# EAGLE design apu_mega_shield (EAGLE 6.5.0)
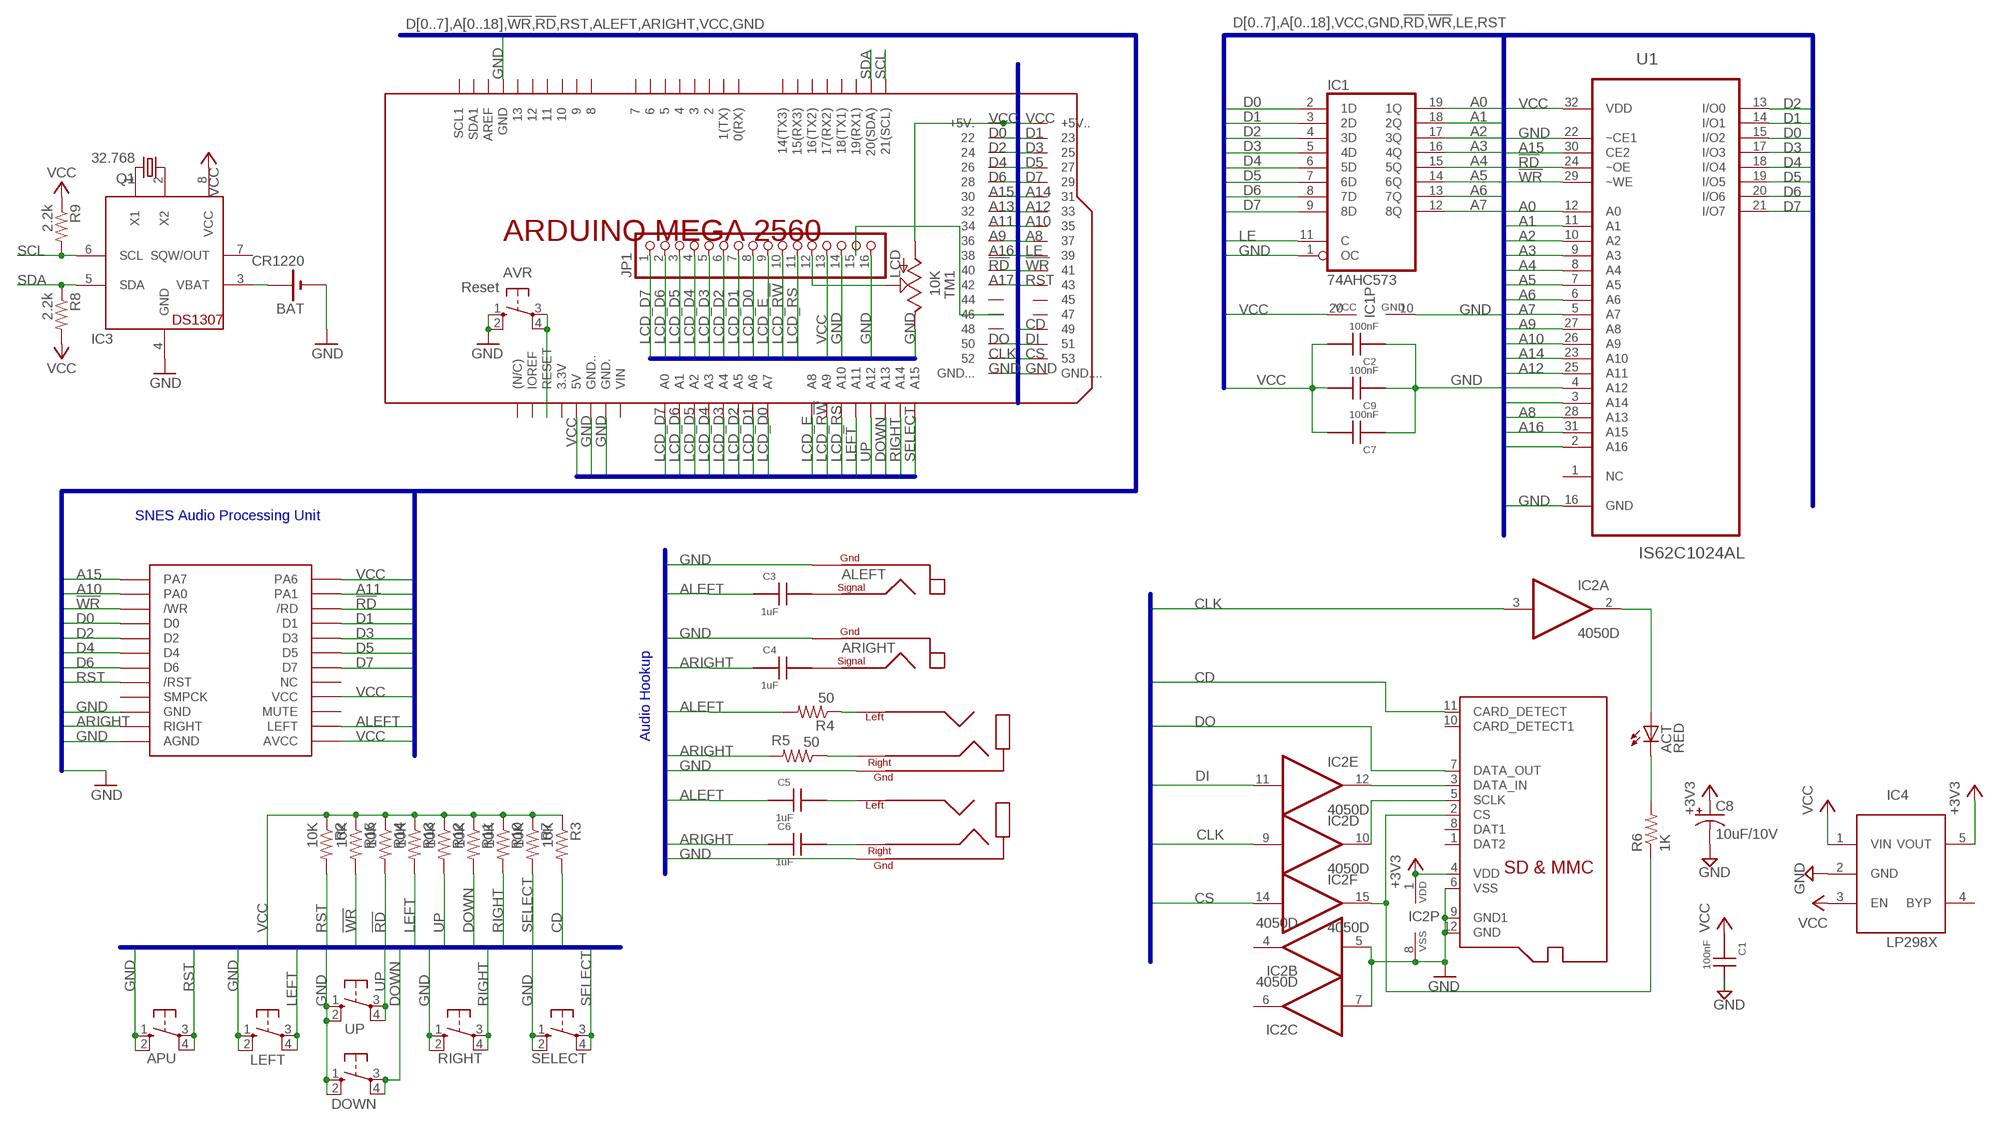
[diagram p0: schematic, sheet 1]

## Parts
ACT  RED  LEDCHIP-LED0805  [CHIP-LED0805]
APU  Reset  10-XX  [B3F-10XX]
AVR  Reset  10-XX  [B3F-10XX]
BAT  CR1220  CR1220SMT  [CR1220-SMD]
C1  100nF  C0805  [C0805]
C2  100nF  C0805  [C0805]
C3  1uF  C0805  [C0805]
C4  1uF  C0805  [C0805]
C5  1uF  C0805  [C0805]
C6  1uF  C0805  [C0805]
C7  100nF  C0805  [C0805]
C8  10uF/10V  CPOL-USA/3216-18R  [A/3216-18R]
C9  100nF  C0805  [C0805]
DOWN  10-XX  [B3F-10XX]
IC1  74AHC573  74HCT573D  [SO20W]
IC2  4050D  [SO16]
IC3  DS1307  DS1307SMT  [SO-08]
IC4  LP298XS  [SOT23-5L]
JP1  LCD  PINHD-1X16  [1X16]
LEFT  10-XX  [B3F-10XX]
Q1  32.768  CRYTALSMD  [SMD]
R2  10K  R-US_R0805  [R0805]
R3  10K  R-US_R0805  [R0805]
R4  50  R-US_R0805  [R0805]
R5  50  R-US_R0805  [R0805]
R6  1K  R-US_R0805  [R0805]
R7  10K  R-US_R0805  [R0805]
R8  2.2k  R-US_R0805  [R0805]
R9  2.2k  R-US_R0805  [R0805]
R10  10K  R-US_R0805  [R0805]
R11  10K  R-US_R0805  [R0805]
R12  10K  R-US_R0805  [R0805]
R13  10K  R-US_R0805  [R0805]
R14  10K  R-US_R0805  [R0805]
R15  10K  R-US_R0805  [R0805]
RIGHT  10-XX  [B3F-10XX]
SELECT  10-XX  [B3F-10XX]
TM1  10K  TRIM_US-CA6H  [CA6H]
U1  IS62C1024AL  IS62C1024AL-35QLI  [SOIC127P1412X305-32N]
U$1  APU  [APU]
U$2  HEADPHONE  [SJ1-3533N]
U$3  HEADPHONE  [SJ1-3533N]
U$4  RCA  [RCJ-01X]
U$5  RCA  [RCJ-01X]
U$6  ARDUINO_MEGA_2560_LITENO_LABELS  [ARDUINO_MEGA2560_LITE_NO_LABELS]
UP  10-XX  [B3F-10XX]
X1  MICROSDMOLEX  [MICROSD-1]

## Nets
!RD: R14.2 U1.24(~OE) U$1.P$6(/RD) U$6.40
!WR: R15.2 U1.29(~WE) U$1.P$5(/WR) U$6.41
+3V3 [supply]: C8.+ IC2.1(P:VDD) IC4.5(VOUT) X1.4(VDD)
A0: IC1.19(1Q) U1.12(A0)
A1: IC1.18(2Q) U1.11(A1)
A2: IC1.17(3Q) U1.10(A2)
A3: IC1.16(4Q) U1.9(A3)
A4: IC1.15(5Q) U1.8(A4)
A5: IC1.14(6Q) U1.7(A5)
A6: IC1.13(7Q) U1.6(A6)
A7: IC1.12(8Q) U1.5(A7)
A8: U1.28(A13) U$6.37
A9: U1.27(A8) U$6.36
A10: U1.26(A9) U$1.P$3(PA0) U$6.35
A11: U1.3(A14) U$1.P$4(PA1) U$6.34
A12: U1.25(A11) U$6.33
A13: U1.4(A12) U$6.32
A14: U1.23(A10) U$6.31
A15: U1.30(CE2) U$1.P$1(PA7) U$6.30
A16: U1.31(A15) U$6.38
A17: U1.2(A16) U$6.42
ALEFT [audio]: C3.1 C5.1 R4.2 U$1.P$22(LEFT)
ARIGHT [audio]: C4.1 C6.1 R5.2 U$1.P$21(RIGHT)
BUF_CLK: IC2.10(D:O) X1.5(SCLK)
BUF_CS: IC2.15(F:O) R6.1 X1.2(CS)
BUF_DI: IC2.12(E:O) X1.3(DATA_IN)
BUF_LED: ACT.A IC2.2(A:O)
CD: R3.2 U$6.49 X1.11(CARD_DETECT)
CLK: IC2.3(A:I) IC2.9(D:I) U$6.52
CS: IC2.14(F:I) U$6.53
D0: IC1.2(1D) U1.15(I/O2) U$1.P$7(D0) U$6.22
D1: IC1.3(2D) U1.14(I/O1) U$1.P$8(D1) U$6.23
D2: IC1.4(3D) U1.13(I/O0) U$1.P$9(D2) U$6.24
D3: IC1.5(4D) U1.17(I/O3) U$1.P$10(D3) U$6.25
D4: IC1.6(5D) U1.18(I/O4) U$1.P$11(D4) U$6.26
D5: IC1.7(6D) U1.19(I/O5) U$1.P$12(D5) U$6.27
D6: IC1.8(7D) U1.20(I/O6) U$1.P$13(D6) U$6.28
D7: IC1.9(8D) U1.21(I/O7) U$1.P$14(D7) U$6.29
DI: IC2.11(E:I) U$6.51
DO: U$6.50 X1.7(DATA_OUT)
DOWN: DOWN.3(P) DOWN.4(P1) R11.2 U$6.A13
GND [supply]: APU.1(S) APU.2(S1) AVR.1(S) AVR.2(S1) BAT.- C1.2 C2.1 C7.1 C8.- C9.1 DOWN.1(S) DOWN.2(S1) IC1.1(OC) IC1.10(GND) IC2.5(B:I) IC2.7(C:I) IC2.8(P:VSS) IC3.4(GND) IC4.2(GND) JP1.14 JP1.16 LEFT.1(S) LEFT.2(S1) RIGHT.1(S) RIGHT.2(S1) SELECT.1(S) SELECT.2(S1) TM1.E U1.16(GND) U1.22(~CE1) U$1.P$19(GND) U$1.P$23(AGND) U$2.GND U$3.GND U$4.PGND1 U$4.PGND2(PGND1) U$4.PGND3(PGND1) U$5.PGND1 U$5.PGND2(PGND1) U$5.PGND3(PGND1) U$6.GND U$6.GND. U$6.GND.. U$6.GND... U$6.GND.... UP.1(S) UP.2(S1) X1.6(VSS) X1.9(GND1) X1.12(GND)
LCD_D0: JP1.8 U$6.A7
LCD_D1: JP1.7 U$6.A6
LCD_D2: JP1.6 U$6.A5
LCD_D3: JP1.5 U$6.A4
LCD_D4: JP1.4 U$6.A3
LCD_D5: JP1.3 U$6.A2
LCD_D6: JP1.2 U$6.A1
LCD_D7: JP1.1 U$6.A0
LCD_E: JP1.9 U$6.A8
LCD_R!W: JP1.10 U$6.A9
LCD_RS: JP1.11 U$6.A10
LE: IC1.11(C) U$6.39
LEFT: LEFT.3(P) LEFT.4(P1) R13.2 U$6.A11
N$1: AVR.3(P) AVR.4(P1) U$6.RESET
N$2 [audio]: C3.2 U$4.PSIG
N$3 [audio]: C4.2 U$5.PSIG
N$4 [audio]: C5.2 U$3.LEFT
N$8 [audio]: C6.2 U$3.RIGHT
N$9 [audio]: R4.1 U$2.LEFT
N$10 [audio]: R5.1 U$2.RIGHT
N$11: ACT.C R6.2
N$13 [supply]: JP1.12 TM1.S
N$14: JP1.15 U$6.46
N$15: BAT.+$1(+) BAT.+$2(+) IC3.3(VBAT)
N$21: IC3.1(X1) Q1.2
N$22: IC3.2(X2) Q1.1
RIGHT: R10.2 RIGHT.3(P) RIGHT.4(P1) U$6.A14
RST: APU.3(P) APU.4(P1) R2.2 U$1.P$15(/RST) U$6.43
SCL: IC3.6(SCL) R9.2 U$6.21(21(SCL))
SDA: IC3.5(SDA) R8.1 U$6.20(20(SDA))
SELECT: R7.2 SELECT.3(P) SELECT.4(P1) U$6.A15
UP: R12.2 U$6.A12 UP.3(P) UP.4(P1)
VCC [supply]: C1.1 C2.2 C7.2 C9.2 IC1.20(VCC) IC3.8(VCC) IC4.1(VIN) IC4.3(EN) JP1.13 R2.1 R3.1 R7.1 R8.2 R9.1 R10.1 R11.1 R12.1 R13.1 R14.1 R15.1 TM1.A U1.32(VDD) U$1.P$2(PA6) U$1.P$18(VCC) U$1.P$24(AVCC) U$6.5V U$6.5V.(+5V.) U$6.5V..(+5V..)
Unconnected: IC2.4(B:O) IC2.6(C:O) IC3.7(SQW/OUT) IC4.4(BYP) U1.1(NC) U$1.P$16(NC) U$1.P$17(SMPCK) U$1.P$20(MUTE) U$6.0(0(RX)) U$6.1(1(TX)) U$6.2 U$6.3 U$6.3.3V U$6.4 U$6.5 U$6.6 U$6.7 U$6.8 U$6.9 U$6.10 U$6.11 U$6.12 U$6.13 U$6.14(14(TX3)) U$6.15(15(RX3)) U$6.16(16(TX2)) U$6.17(17(RX2)) U$6.18(18(TX1)) U$6.19(19(RX1)) U$6.44 U$6.45 U$6.47 U$6.48 U$6.AREF U$6.I/OREF(IOREF) U$6.N/C((N/C)) U$6.SCL1 U$6.SDA1 U$6.VIN X1.1(DAT2) X1.8(DAT1) X1.10(CARD_DETECT1)

## Buses
D[0..7],A[0..18],VCC,GND,!RD,!WR,LE,RST
D[0..7],A[0..18],!WR,!RD,RST,ALEFT,ARIGHT,VCC,GND
D[0..7],A[0..18],VCC,GND,!RD,!WR,LE,CD,DO,DI,CLK,CS
D[0..7],A[0..18],VCC,GND,!RD,!WR,LE,CD,DO,DI,CLK,CS,RST
D[0..7],A[0..1],WR,RD,RST,ALEFT,ARIGHT,GND
RST,!WR,!RD,UP,DOWN,LEFT,RIGHT,SELECT,VCC,GND,LCD_D[0..7],LCD_E,LCD_R!W,LCD_RS
RST,!WR,!RD,UP,DOWN,LEFT,RIGHT,SELECT,VCC,GND,CD

## Notes on the sheet
- SNES Audio Processing Unit
- Audio Hookup

## Library data of the parts
ACT = adafruit:LED: LED OSRAM: - CHIPLED LG R971, LG N971, LY N971, LG Q971, LY Q971, LO R971, LY R971 LH N974, LH R974 LS Q976, LO Q976, LY Q976 LO Q996 - Hyper CHIPLED LW Q18S LB Q993, LB Q99A, LB R99A - SideLED LS A670, LO A670, LY A670, LG A670, LP A670 LB A673, LV A673, LT A673, LW A673 LH A674 LY A675 LS A676, LA A676, LO A676, LY A676, LW A676 LS A679, LY A679, LG A679 - Hyper Micro SIDELED® LS Y876, LA Y876, LO Y876, LY Y876 LT Y87S - SmartLED LW L88C, LW L88S LB L89C, LB L89S, LG L890 LS L89K, LO L89K, LY L89K LS L896, LA L896, LO L896, LY L896 - TOPLED LS T670, LO T670, LY T670, LG T670, LP T670 LSG T670, LSP T670, LSY T670, LOP T670, LYG T670 LG T671, LOG T671, LSG T671 LB T673, LV T673, LT T673, LW T673 LH T674 LS T676, LA T676, LO T676, LY T676, LB T676, LH T676, LSB T676, LW T676 LB T67C, LV T67C, LT T67C, LS T67K, LO T67K, LY T67K, LW E67C LS E67B, LA E67B, LO E67B, LY E67B, LB E67C, LV E67C, LT E67C LW T67C LS T679, LY T679, LG T679 LS T770, LO T770, LY T770, LG T770, LP T770 LB T773, LV T773, LT T773, LW T773 LH T774 LS E675, LA E675, LY E675, LS T675 LS T776, LA T776, LO T776, LY T776, LB T776 LHGB T686 LT T68C, LB T68C - Hyper Mini TOPLED® LB M676 - Mini TOPLED Santana® LG M470 LS M47K, LO M47K, LY M47K Source: http://www.osram.convergy.de/
APU AVR DOWN LEFT RIGHT SELECT UP = switch-omron:10-XX: OMRON SWITCH
BAT = adafruit:CR1220: CR1216/CR1220/CR1225 12mm 3V lithium coin cell Great for battery packup. Both SMT and THM holders. Note the THM package has the ground pads on both sides of the PCB so that the masks are the same - this reduces the cost
C1-C7 C9 = apu_pcb:C0805
C8 = adafruit:CPOL-US: POLARIZED CAPACITOR, American symbol
IC1 = 74xx-eu:74*573: 8-bit D latch BUS DRIVER
IC2 = 40xx:4050: Hex non-inverting BUFFER
IC3 = adafruit:DS1307: DS1307 Real time clock (RTC) with battery backup ability. Talk to it via i2c
IC4 = adafruit:LP298X
JP1 = pinhead:PINHD-1X16: PIN HEADER
Q1 = crystal:CRYTAL: CRYSTAL
R2-R15 = adafruit:R-US_: RESISTOR, American symbol
TM1 = pot:TRIM_US-: POTENTIOMETER
U1 = ISSI_By_element14_Batch_1:IS62C1024AL-35QLI: STATIC RAM; MPN: IS62C1024AL-35QLI; OC_FARNELL: 1869973; OC_NEWARK: 43M5399; PACKAGE: SOIC-32; SUPPLIER: INTEGRATED SILICON SOLUTION (ISSI)
U$1 = caitsith2:APU
U$2 U$3 = caitsith2:HEADPHONE
U$4 U$5 = caitsith2:RCA
U$6 = E14_Arduino_revB:ARDUINO_MEGA_2560_LITE
X1 = adafruit:MICROSD: Micro-SD / Transflash card holder with SPI pinout For the 3M # 2908-05WB-MG and/or 4UCON #19656 push-push type

## Net classes
0 default: width 0.152 mm, clearance 0.152 mm
1 supply: width 0.305 mm, clearance 0.152 mm
2 audio: width 0.305 mm, clearance 0.152 mm

## Board
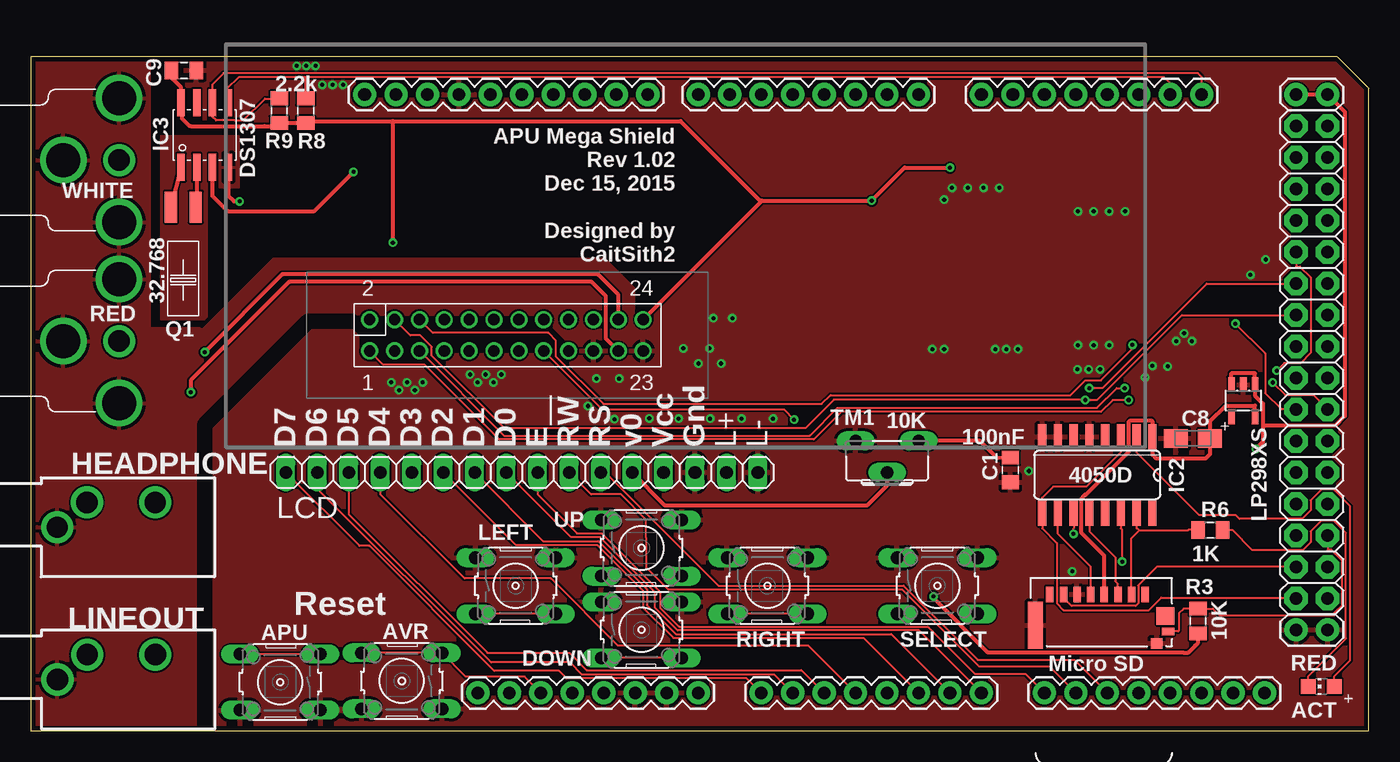
[diagram p1: board, top side]
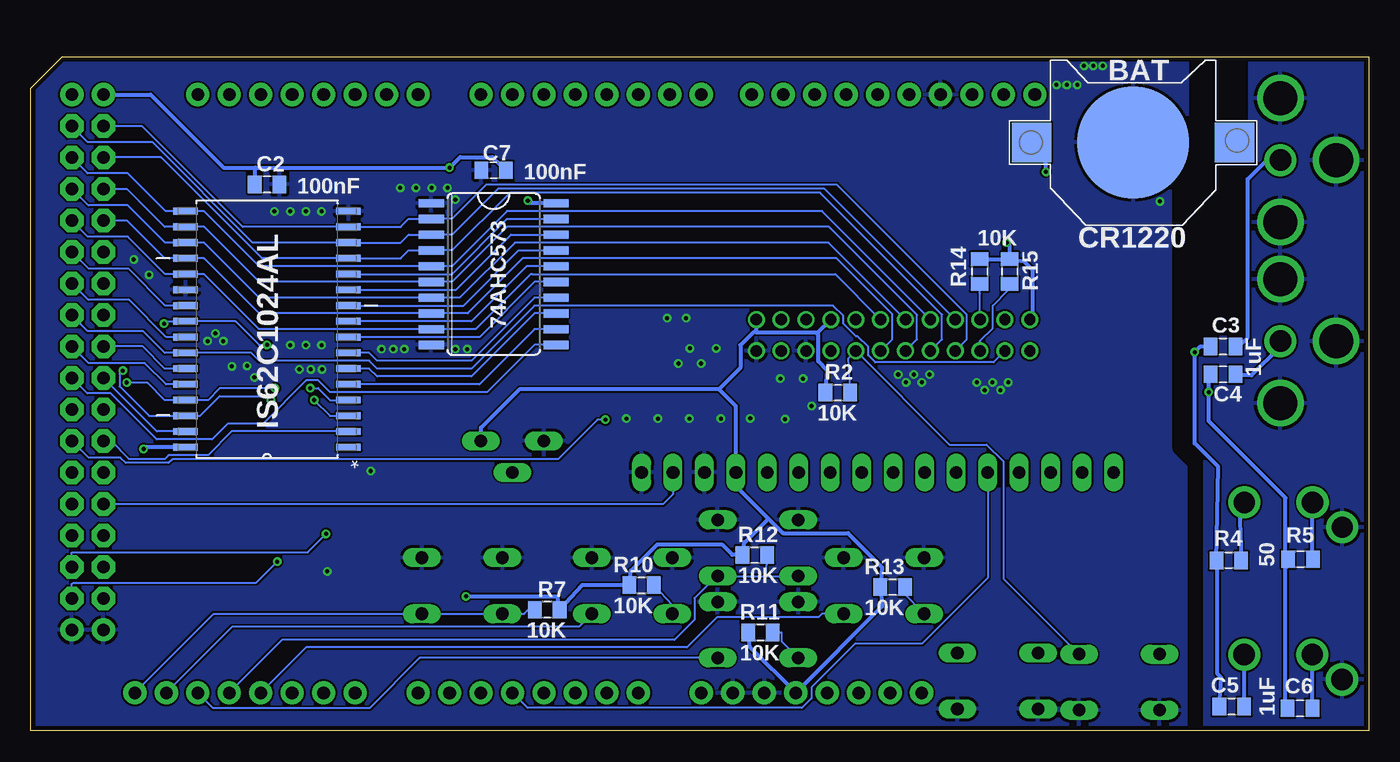
[diagram p2: board, bottom side, seen from below]

Size 107.95 x 54.36 mm. Coordinates in mm from the lower left corner, seen from the top.
Outline: 0,0 107.95,0 107.95,51.82 105.41,54.36 0,54.36 0,0
Copper layers (1*16): Top 0.0356mm / dielectric 1.5011mm / Bottom 0.0356mm
Design rules "oshpark-2layer": minimum track width 6mil, minimum drill 13mil, track to track 6mil, track to pad 6mil, pad to pad 6mil, via to via 6mil, smd to smd 6mil, copper to edge 15mil, drill to drill 6mil, minimum pad ring 7mil, minimum via ring 7mil, stop-mask expansion 4mil, vias tented up to drill 0mil, thermal gap 10mil
tRestrict: 11 lines
bRestrict: 3 lines

### Footprints (pad centres in the part's own frame; a part is rotated, then mirrored left to right if it is on the bottom)
CHIP-LED0805 = smd 1.2 x 1.2: A 0,-1.05; C 0,1.05
B3F-10XX = drill 1.016 long: 1 -3.251,2.261; 2 3.251,2.261; 3 -3.251,-2.261; 4 3.251,-2.261
CR1220-SMD = smd 3.2 x 3.2: +$1 -8.2,0; +$2 8.2,0 | smd 9 x 9: - 0,0
C0805 = smd 1.1 x 1.4: 1 -1,0; 2 1,0
A/3216-18R = smd 1.95 x 1.5: + 1.375,0; - -1.375,0
SO20W = smd 0.66 x 2.032: 1 -5.715,-5.029; 2 -4.445,-5.029; 3 -3.175,-5.029; 4 -1.905,-5.029; 5 -0.635,-5.029; 6 0.635,-5.029; 7 1.905,-5.029; 8 3.175,-5.029; 9 4.445,-5.029; 10 5.715,-5.029; 11 5.715,5.029; 12 4.445,5.029; 13 3.175,5.029; 14 1.905,5.029; 15 0.635,5.029; 16 -0.635,5.029; 17 -1.905,5.029; 18 -3.175,5.029; 19 -4.445,5.029; 20 -5.715,5.029
SO16 = smd 0.66 x 2.032: 1 -4.445,-3.073; 2 -3.175,-3.073; 3 -1.905,-3.073; 4 -0.635,-3.073; 5 0.635,-3.073; 6 1.905,-3.073; 7 3.175,-3.073; 8 4.445,-3.073; 9 4.445,3.073; 10 3.175,3.073; 11 1.905,3.073; 12 0.635,3.073; 13 -0.635,3.073; 14 -1.905,3.073; 15 -3.175,3.073; 16 -4.445,3.073
SO-08 = smd 0.6 x 2.2: 1 -1.905,-2.6; 2 -0.635,-2.6; 3 0.635,-2.6; 4 1.905,-2.6; 5 1.905,2.6; 6 0.635,2.6; 7 -0.635,2.6; 8 -1.905,2.6
SOT23-5L = smd 0.55 x 1.2: 1 -0.95,-1.3; 2 0,-1.3; 3 0.95,-1.3; 4 0.95,1.3; 5 -0.95,1.3
1X16 = drill 1.016 long: 1 -19.05,0; 2 -16.51,0; 3 -13.97,0; 4 -11.43,0; 5 -8.89,0; 6 -6.35,0; 7 -3.81,0; 8 -1.27,0; 9 1.27,0; 10 3.81,0; 11 6.35,0; 12 8.89,0; 13 11.43,0; 14 13.97,0; 15 16.51,0; 16 19.05,0
SMD = smd 2.5 x 1: 1 2.25,-1; 2 2.25,1
R0805 = smd 1.1 x 1.4: 1 -1,0; 2 1,0
CA6H = drill 1.016 long: A -2.54,0; E 2.54,0; S 0,2.54
SOIC127P1412X305-32N = smd 1.981 x 0.559: 1 -6.579,9.525; 2 -6.579,8.255; 3 -6.579,6.985; 4 -6.579,5.715; 5 -6.579,4.445; 6 -6.579,3.175; 7 -6.579,1.905; 8 -6.579,0.635; 9 -6.579,-0.635; 10 -6.579,-1.905; 11 -6.579,-3.175; 12 -6.579,-4.445; 13 -6.579,-5.715; 14 -6.579,-6.985; 15 -6.579,-8.255; 16 -6.579,-9.525; 17 6.579,-9.525; 18 6.579,-8.255; 19 6.579,-6.985; 20 6.579,-5.715; 21 6.579,-4.445; 22 6.579,-3.175; 23 6.579,-1.905; 24 6.579,-0.635; 25 6.579,0.635; 26 6.579,1.905; 27 6.579,3.175; 28 6.579,4.445; 29 6.579,5.715; 30 6.579,6.985; 31 6.579,8.255; 32 6.579,9.525
APU = drill 0.914: P$1 0,0; P$2 0,-2.54; P$3 -2.007,0; P$4 -2.007,-2.54; P$5 -4.013,0; P$6 -4.013,-2.54; P$7 -6.02,0; P$8 -6.02,-2.54; P$9 -8.026,0; P$10 -8.026,-2.54; P$11 -10.033,0; P$12 -10.033,-2.54; P$13 -12.04,0; P$14 -12.04,-2.54; P$15 -14.046,0; P$16 -14.046,-2.54; P$17 -16.053,0; P$18 -16.053,-2.54; P$19 -18.059,0; P$20 -18.059,-2.54; P$21 -20.066,0; P$22 -20.066,-2.54; P$23 -22.073,0; P$24 -22.073,-2.54
SJ1-3533N = drill 1.727: GND -4.7,0; LEFT 3.2,2; RIGHT -2.3,2
RCJ-01X = drill 2.743: PGND1 0,5; PGND2 4.5,0; PGND3 0,-5 | drill 1.727: PSIG 0,0
ARDUINO_MEGA2560_LITE_NO_LABELS = drill 1.016 pad 1.88: 0 63.5,50.8; 1 60.96,50.8; 2 58.42,50.8; 3 55.88,50.8; 3.3V 35.56,2.54; 4 53.34,50.8; 5 50.8,50.8; 5V 38.1,2.54; 5V. 93.98,50.8; 5V.. 96.52,50.8; 6 48.26,50.8; 7 45.72,50.8; 8 41.656,50.8; 9 39.116,50.8; 10 36.576,50.8; 11 34.036,50.8; 12 31.496,50.8; 13 28.956,50.8; 14 68.58,50.8; 15 71.12,50.8; 16 73.66,50.8; 17 76.2,50.8; 18 78.74,50.8; 19 81.28,50.8; 20 83.82,50.8; 21 86.36,50.8; A0 50.8,2.54; A1 53.34,2.54; A2 55.88,2.54; A3 58.42,2.54; A4 60.96,2.54; A5 63.5,2.54; A6 66.04,2.54; A7 68.58,2.54; A8 73.66,2.54; A9 76.2,2.54; A10 78.74,2.54; A11 81.28,2.54; A12 83.82,2.54; A13 86.36,2.54; A14 88.9,2.54; A15 91.44,2.54; AREF 23.876,50.8; GND 26.416,50.8; GND. 43.18,2.54; GND.. 40.64,2.54; GND... 93.98,7.62; GND.... 96.52,7.62; I/OREF 30.48,2.54; N/C 27.94,2.54; RESET 33.02,2.54; SCL1 18.796,50.8; SDA1 21.336,50.8; VIN 45.72,2.54 | drill 1.016 pad 1.88 octagon: 22 93.98,48.26; 23 96.52,48.26; 24 93.98,45.72; 25 96.52,45.72; 26 93.98,43.18; 27 96.52,43.18; 28 93.98,40.64; 29 96.52,40.64; 30 93.98,38.1; 31 96.52,38.1; 32 93.98,35.56; 33 96.52,35.56; 34 93.98,33.02; 35 96.52,33.02; 36 93.98,30.48; 37 96.52,30.48; 38 93.98,27.94; 39 96.52,27.94; 40 93.98,25.4; 41 96.52,25.4; 42 93.98,22.86; 43 96.52,22.86; 44 93.98,20.32; 45 96.52,20.32; 46 93.98,17.78; 47 96.52,17.78; 48 93.98,15.24; 49 96.52,15.24; 50 93.98,12.7; 51 96.52,12.7; 52 93.98,10.16; 53 96.52,10.16
MICROSD-1 = smd 0.6 x 1.25: 1 8.85,4.175; 2 7.75,4.175; 3 6.65,4.175; 4 5.55,4.175; 5 4.45,4.175; 6 3.35,4.175; 7 2.25,4.175; 8 1.15,4.175 | smd 1.2 x 3.79: 9 0,1.695 | smd 1.45 x 1.4: 10 10.475,2.45 | smd 1 x 0.6: 11 10.7,1.2 | smd 0.95 x 0.85: 12 9.775,0.225

### Placement (x,y rotation side)
ACT  104.14,3.56 90 top
APU  20.12,3.91 180 top
AVR  29.93,4 180 top
BAT  19,47.45 0 bottom
C1  79.04,21.03 270 top
C2  88.9,44.07 180 bottom
C3  11.73,30.99 0 bottom
C4  11.73,28.75 0 bottom
C5  11.04,1.94 0 bottom
C6  5.52,1.8 0 bottom
C7  70.61,45.21 0 bottom
C8  93.78,23.57 0 top
C9  12.34,53.26 180 top
DOWN  49.28,8.13 0 top
IC1  70.61,36.83 270 bottom
IC2  86.06,20.62 180 top
IC3  14.02,48.06 0 top
IC4  97.84,26.62 180 top
JP1  39.62,20.83 0 top
LEFT  39.12,11.68 0 top
Q1  12.29,39.98 90 top
R2  42.82,27.28 0 bottom
R3  94.2,8.84 90 top
R4  11.28,13.72 180 bottom
R5  5.49,13.82 180 bottom
R6  95.18,16.19 0 top
R7  66.29,9.75 180 bottom
R8  22.17,50.01 270 top
R9  20.04,50.01 90 top
R10  58.67,11.73 0 bottom
R11  49.07,7.92 0 bottom
R12  49.53,14.17 0 bottom
R13  38.4,11.58 0 bottom
R14  31.39,37.03 270 bottom
R15  28.96,37.03 270 bottom
RIGHT  59.44,11.68 0 top
SELECT  73.15,11.68 0 top
TM1  69.09,23.37 180 top
U1  88.9,32.38 180 bottom
U$1  27.34,30.62 180 top
U$2  6.82,16.41 0 top
U$3  6.84,4.12 0 top
U$4  7.11,46.02 180 top
U$5  7.11,31.42 180 top
U$6  8.13,0.51 0 top
UP  49.28,14.73 0 top
X1  81.08,6.81 0 top

### Tracks (layer width: path | path; a pad name or v marks a point on that pad's centre or on a via)
!RD  (via drill 0.33, 0.33 pad 0.69)
  Top 0.152: v97.2,32.84 99.61,30.44 99.61,27.24 100.94,25.91 U$6.40 | U$1.P$6 32.43,32.08 41.76,32.08 42.37,31.47 42.37,30.18 46.19,26.35 63.82,26.35 64.53,27.06 83.9,27.06 85.09,28.26 86.36,28.26 88.9,30.8 v88.9,31.11
  Bottom 0.152: R14.2 31.39,35.3 31.35,35.26 U$1.P$6 | v97.2,32.84 97.17,33.02 U1.24 91.44,33.02 89.53,31.11 v88.9,31.11
!WR  (via drill 0.33, 0.33 pad 0.69)
  Top 0.152: v100.22,28.08 101.22,27.08 103.48,27.08 U$6.41 | U$1.P$5 38.17,23.8 62.85,23.8 65.09,26.04 86.04,26.04 87.63,27.62 v88.27,27.62
  Bottom 0.152: U$1.P$5 31.35,31.44 30.33,32.46 30.33,34.29 29.11,35.51 29.11,36.03 R15.2 | v100.22,28.08 100.19,28.05 98.54,28.05 97.16,26.67 U1.29 93.66,26.67 92.71,27.62 v88.27,27.62
+3V3
  Top 0.305: X1.4 86.63,14.11 84.78,15.95 84.78,18.72 84.88,18.82 84.93,18.88 85.03,18.97 85.09,19.05 85.16,19.05 88.59,22.49 88.59,24.89 88.74,25.04 90.4,25.04 90.5,24.94 IC2.1 90.53,23.67 90.53,22.25 90.83,21.95 94.79,21.95 95.15,22.3 C8.+ 95.15,24.94 96.44,26.22 98.79,26.22 IC4.5 98.73,25.32
A0
  Bottom 0.152: U1.12 73.98,36.83 69.53,41.27 IC1.19
A1
  Bottom 0.152: U1.11 73.66,35.56 69.22,40.01 IC1.18
A2
  Bottom 0.152: U1.10 73.03,34.29 68.58,38.73 IC1.17
A3
  Bottom 0.152: IC1.16 67.94,37.47 72.39,33.02 U1.9
A4
  Bottom 0.152: IC1.15 67.31,36.2 71.75,31.75 U1.8
A5
  Bottom 0.152: IC1.14 67.31,34.92 72.39,29.84 80.01,29.84 80.64,30.48 U1.7
A6
  Bottom 0.152: IC1.13 67.31,33.66 72.39,28.57 80.01,28.57 80.64,29.21 U1.6
A7
  Bottom 0.152: IC1.12 67.31,32.38 71.75,27.94 U1.5
A8
  Bottom 0.152: U1.28 97.05,27.94 98.75,29.64 103.3,29.64 U$6.37
A9
  Bottom 0.152: U1.27 97.16,29.21 98.93,30.99 U$6.36
A10
  Bottom 0.152: U$1.P$3 30.26,29.71 39.81,29.71 40.38,30.28 40.38,30.95 41.23,31.81 41.35,31.81 42.38,32.84 42.38,33.46 43.22,34.29 67.15,34.29 67.31,34.29 72.39,29.21 80.01,29.21 80.64,29.84 89.53,29.84 90.17,30.48 U1.26 97.16,30.48 98.91,32.23 103.35,32.23 U$6.35
A11  (via drill 0.33)
  Top 0.152: U$1.P$4 30.61,31.89 31.41,31.89 32.35,30.95 32.35,30.26 38.22,24.39 62.49,24.39 64.8,26.7 85.09,26.7 v85.09,26.67 86.04,26.67 92.9,33.53 U$6.34
  Bottom 0.152: v85.09,26.67 83.82,25.4 U1.3
A12
  Bottom 0.152: U1.25 97.04,31.75 100.04,34.75 103.33,34.75 U$6.33
A13  (via drill 0.33)
  Top 0.152: U$6.32 94.89,36.07 86.45,27.62 v85.41,27.62
  Bottom 0.152: v85.41,27.62 84.77,27.62 83.82,26.67 U1.4
A14
  Bottom 0.152: U1.23 97.1,34.29 100.08,37.26 103.3,37.26 U$6.31
A15  (via drill 0.33, 0.33 pad 0.69)
  Top 0.152: v100.53,29.05 101.14,29.65 102.47,29.65 103.28,30.47 103.28,36.57 102.41,37.44 102.11,37.44 U$6.30 | U$1.P$1 28.43,29.53 31.75,29.53 37.78,23.5 63.18,23.5 65.25,25.56 65.41,25.72 86.36,25.72 87.31,26.67 v88.58,26.67
  Bottom 0.152: v100.53,29.05 100.79,28.79 100.79,27.77 98.42,25.4 U1.30 94.3,25.4 92.71,26.99 88.9,26.99 v88.58,26.67
A16
  Bottom 0.152: U1.31 97.79,24.13 U$6.38
A17
  Bottom 0.152: U1.2 91.76,24.13 93.66,22.23 96.84,22.23 97.16,21.91 100.01,21.91 101.47,23.37 U$6.42
ALEFT  (via drill 0.33 pad 0.69)
  Top 0.305: v14.02,30.53 20.29,36.8 45.75,36.8 47.4,35.15 U$1.P$22
  Bottom 0.305: v14.02,30.53 14.02,30.48 | C5.1 11.89,4.27 12.19,4.57 12.19,13.65 R4.2 12.13,21.27 14.02,23.16 v14.02,30.53 | v14.02,30.53 13.56,30.99 C3.1
ARIGHT  (via drill 0.33 pad 0.69)
  Top 0.305: U$1.P$21 46.41,31.62 46.41,35.03 45.24,36.2 20.84,36.2 12.9,28.26 v12.9,27.3
  Bottom 0.305: C4.1 12.9,28.08 v12.9,27.3 12.9,24.97 12.06,24.13 6.71,18.77 6.71,14.19 R5.2 6.34,13.48 6.71,13.11 6.71,2.13 C6.1
BUF_CLK
  Top 0.152: X1.5 85.53,13.23 82.88,15.88 IC2.10
BUF_CS
  Top 0.152: R6.1 93.4,16.19 93.37,16.15 89.46,16.15 | IC2.15 89.23,16.31 89.31,16.31 89.46,16.15 | X1.2 88.83,15.52 89.46,16.15
BUF_DI
  Top 0.152: X1.3 87.73,11.84 87.51,12.05 87.51,13.99 85.42,16.08 IC2.12
BUF_LED
  Top 0.152: IC2.2 89.23,22.45 94.31,17.37 97.23,17.37 97.53,17.07 102.59,17.07 103.28,17.76 103.28,18.57 104.16,19.46 105.13,19.46 106.47,18.12 106.47,5.67 105.19,4.38 ACT.A
CD
  Top 0.152: U$6.49 104.65,14.58 104.94,14.58 105.82,13.7 105.82,10.13 105.18,9.5 | 105.18,9.49 105.18,9.5 | 105.18,9.5 105.23,9.45 105.23,9.37 105.16,9.3 95.94,9.3 95.4,9.83 94.26,9.83 R3.2 94.18,9.83 93.04,9.83 92.66,9.45 92.66,9.37 92.66,8.08 92.58,8 91.82,8 X1.11
CLK
  Top 0.152: U$6.52 100.94,10.67 100.89,10.72 91.22,10.72 90.22,9.72 83.34,9.72 82.8,10.26 82.8,15.12 81.61,16.31 IC2.9 81.61,18.8 82.5,19.68 85.19,19.68 87.96,22.45 IC2.3
CS  (via drill 0.33 pad 0.69)
  Top 0.152: IC2.14 87.96,16.31 88.08,16.19 v88.08,13.63
  Bottom 0.152: v88.08,13.63 89.78,11.92 104.56,11.92 104.65,11.84 U$6.53
D0
  Bottom 0.152: U$1.P$7 32.41,31.57 32.41,33.54 42.9,44.02 71.23,44.02 73.98,41.27 IC1.2 77.47,41.27 78.11,40.64 U1.15 90.86,40.64 98.98,48.77 U$6.22
D1
  Bottom 0.152: U$1.P$8 43.9,43.71 70.27,43.71 73.98,40.01 IC1.3 77.47,40.01 78.11,39.37 U1.14 90.04,39.37 98.15,47.47 103.35,47.47 U$6.23
D2
  Bottom 0.152: U$1.P$9 34.42,31.57 34.42,33.56 44.27,43.41 69.3,43.41 73.98,38.73 IC1.4 77.47,38.73 78.11,38.1 U1.13 89.31,38.1 97.46,46.25 102.08,46.25 U$6.24
D3
  Bottom 0.152: U$1.P$10 44.11,41.91 69.53,41.91 73.98,37.47 IC1.5 89.53,37.47 93.98,41.91 U1.17 97.08,41.91 100.13,44.96 103.38,44.96 U$6.25
D4
  Bottom 0.152: U$1.P$11 36.43,31.57 36.43,33.54 43.53,40.64 69.53,40.64 73.98,36.2 IC1.6 89.53,36.2 93.98,40.64 U1.18 97.16,40.64 100.2,43.69 U$6.26
D5
  Bottom 0.152: U$1.P$12 43.57,39.37 68.9,39.37 73.34,34.92 IC1.7 89.53,34.92 93.98,39.37 U1.19 97.13,39.37 100.13,42.37 103.33,42.37 U$6.27
D6
  Bottom 0.152: U$1.P$13 38.43,31.57 38.43,33.59 42.94,38.1 68.26,38.1 72.71,33.66 IC1.8 89.53,33.66 93.98,38.1 U1.20 97.16,38.1 100.2,41.15 U$6.28
D7
  Bottom 0.152: 39.38,33.21 U$1.P$14 43.04,36.83 67.5,36.83 67.63,36.83 72.07,32.38 IC1.9 89.53,32.38 93.98,36.83 U1.21 97.1,36.83 100.13,39.85 103.35,39.85 U$6.29
DI  (via drill 0.33 pad 0.69)
  Top 0.152: v84.13,15.87 84.13,16.29 84.15,16.31 IC2.11 84.12,17.58
  Bottom 0.152: v84.13,15.87 85.62,14.38 104.65,14.38 U$6.51
DO
  Top 0.152: U$6.50 90.85,13.21 89.36,11.71 89.36,10.26 89.16,10.06 83.98,10.06 83.33,10.72 X1.7
DOWN
  Top 0.152: DOWN.4 DOWN.3
  Bottom 0.152: R11.2 47.34,7.92 47.34,7.19 DOWN.3 | DOWN.4 76.58,5.87 80.64,1.81 93.25,1.81 U$6.A13
GND  (via drill 0.33 pad 0.69)
  Top 0.305: IC3.4 15.93,43.16 16.38,42.7 v16.84,42.7
  other vias: 56.61,33.28 55.08,33.28 55.69,29.62 54.78,30.84 53.86,29.62 52.65,30.84 47.46,28.4 45.63,28.4 80.53,20.94 84.04,12.85 77.83,30.78 78.71,30.78 84.45,29.14 85.37,29.14 86.28,29.14 89.92,28.5 90.51,29.42 91.74,29.38 98.42,36.77 99.66,38 73.7,30.78 72.75,30.78 79.67,30.78 73.7,42.84 74.33,43.79 75.6,43.79 76.87,43.79 78.14,43.79 84.49,41.89 85.76,41.89 87.03,41.89 88.3,41.89 84.49,31.09 85.76,31.09 87.03,31.09 92.43,31.41 93.7,31.41 93.07,32.05 25.18,52.1 24.35,52.1 23.51,52.1 21.45,53.62 22.21,53.62 22.97,53.62 49.9,25.2 47.08,25.12 44.95,26.19 37.96,28.73 36.69,28.73 35.42,28.73 36.06,28.09 37.33,28.09 31.61,28.09 30.34,28.09 29.07,28.09 29.71,27.46 30.98,27.46 52.28,25.17 54.82,25.17 57.36,25.17 59.9,25.17
  pour Bottom: 14.61,54.48 107.98,54.48 107.98,-0.13 14.61,-0.13
  pour Top: 14.81,33.88 18.08,37.06 18.21,49.38 12.52,49.4 12.52,54.36 108.13,54.36 108.13,0 14.61,0
  pour Top: 10.52,33.17 10.52,47.96 16.76,47.96 16.76,43.84 15.24,43.84 15.24,46.58 14.17,46.58 14.17,33.17
  pour Top: 0,0 13.34,0 13.34,24.77 22.2,33.63 41.45,33.63 41.33,31.55 49.33,31.55 48.9,36.2 46.35,38.73 20,38.73 13.65,32.38 9.53,32.38 9.53,53.98 0,53.98
  pour Bottom: 0,0 13.97,0 13.97,31.75 9.53,31.75 9.53,53.98 0,53.98
LCD_D0
  Top 0.152: U$6.A7 71.67,8.08 52.18,8.08 50.35,9.92 50.35,11.18 45.93,15.6 43.58,15.6 JP1.8
LCD_D1
  Top 0.152: JP1.7 41.35,15.29 45.8,15.29 49.7,11.39 49.7,10.13 52.06,7.78 69.44,7.78 U$6.A6
LCD_D2
  Top 0.152: JP1.6 39.11,14.99 45.67,14.99 49.4,11.27 49.4,9.93 51.85,7.47 67.2,7.47 U$6.A5
LCD_D3
  Bottom 0.152: JP1.5 30.73,12.32 36.05,7.01 41.43,7.01 44.96,3.48 44.96,2.6 45.73,1.83 67.87,1.83 U$6.A4
LCD_D4
  Top 0.152: JP1.4 28.19,19.07 35,12.27 41.97,12.27 47.39,6.86 62.74,6.86 U$6.A3
LCD_D5
  Top 0.152: JP1.3 25.65,17.46 36.84,6.28 43.45,6.28 44.85,4.88 62.18,4.88 U$6.A2
LCD_D6
  Top 0.152: U$6.A1 59.99,4.52 44.49,4.52 43.51,5.5 37.14,5.5 23.11,19.53 JP1.2
LCD_D7
  Top 0.152: U$6.A0 57.76,4.22 43.22,4.22 42.62,4.82 37.39,4.82 27.32,14.89 26.51,14.89 JP1.1
LCD_E
  Top 0.152: JP1.9 40.89,19.07 44.06,15.9 46.05,15.9 50.77,11.18 50.77,9.92 52.31,8.39 72.39,8.39 76.2,4.57 80.26,4.57 U$6.A8
LCD_R!W
  Top 0.152: U$6.A9 82.19,5.18 76.5,5.18 70.29,11.4 51.42,11.4 49.65,13.17 49.65,15.54 49.65,17.03 47.62,19.05 45.21,19.05 JP1.10
LCD_RS
  Top 0.152: JP1.11 46.35,20.83 55.48,11.7 70.43,11.7 76.42,5.71 84.21,5.71 U$6.A10
LE
  Bottom 0.152: IC1.11 67.31,31.11 71.12,27.3 83.82,27.3 84.77,28.26 85.72,28.26 89.22,24.77 92.08,24.77 93.34,23.5 97.79,23.5 101.5,27.2 103.4,27.2 U$6.39
LEFT
  Top 0.152: LEFT.4 LEFT.3
  Bottom 0.152: LEFT.4 44.12,9.42 44.4,9.14 52.58,9.14 55.02,6.71 85.75,6.71 U$6.A11 | R13.2 37.55,11.11 LEFT.3
N$1
  Top 0.152: U$6.RESET 39.85,4.35 35.09,4.35 AVR.3 AVR.4
N$2
  Bottom 0.305: C3.2 10.46,30.99 9.75,31.7 9.75,44.5 8.23,46.02 U$4.PSIG
N$3
  Bottom 0.305: U$5.PSIG 7.26,30.84 9.45,28.65 10.63,28.65 C4.2
N$4
  Bottom 0.305: C5.2 10.04,2.09 U$3.LEFT
N$8
  Bottom 0.305: C6.2 4.54,1.93 U$3.RIGHT
N$9
  Bottom 0.305: U$2.LEFT 10.43,18 R4.1
N$10
  Bottom 0.305: R5.1 4.52,13.93 U$2.RIGHT
N$11
  Top 0.152: R6.2 96.96,16.19 98.58,14.57 102.64,14.57 103.28,15.21 103.28,16.07 104.15,16.95 105.13,16.95 106.13,15.95 106.13,7.42 103.09,4.38 ACT.C
N$13
  Top 0.305: JP1.12 51.14,18.2 67.53,18.2 69.09,19.76 TM1.S
N$14
  Bottom 0.152: U$6.46 100.94,18.29 100.92,18.27 56.94,18.27 56.13,19.07 JP1.15
N$15  (via drill 0.33)
  Top 0.305: v26.04,45.09 22.86,41.91 15.88,41.91 14.66,43.13 IC3.3
  Bottom 0.305: 10.97,47.27 BAT.+$2 | v26.04,45.09 26.04,46.28 BAT.+$1
N$21
  Top 0.305: IC3.1 Q1.2
N$22
  Top 0.305: IC3.2 13.39,42.23 Q1.1
RIGHT
  Top 0.152: RIGHT.4 RIGHT.3
  Bottom 0.152: RIGHT.4 63.73,8.38 91.69,8.38 U$6.A14 | RIGHT.3 56.19,10.1 R10.2
RST  (via drill 0.33)
  Top 0.152: U$1.P$15 46.08,25.92 60.75,25.92 v61.59,25.08 | APU.3 APU.4
  Bottom 0.152: R2.2 41.97,30.03 U$1.P$15 33.84,23.08 30.82,23.08 29.46,21.72 29.46,12.27 APU.3 | v61.59,25.08 62.23,25.08 65.41,21.91 96.52,21.91 96.84,21.59 100.31,21.59 100.74,22.02 103.3,22.02 U$6.43
SCL
  Top 0.152: U$6.21 94.49,52.73 94.18,53.03 15.54,53.03 14.63,52.12 14.63,50.68 IC3.6 14.63,50.63 14.63,49.53 14.94,49.23 16.46,49.23 17.14,49.23 18.9,50.98 20.01,50.98 R9.2
SDA
  Top 0.152: R8.1 22.17,52.65 22.25,52.73 | 22.25,52.73 16.76,52.73 15.85,51.82 15.85,50.73 IC3.5 | U$6.20 91.95,52.22 91.44,52.73 22.25,52.73
SELECT
  Bottom 0.152: R7.2 67.82,9.75 68.15,9.42 SELECT.3 SELECT.4 93.19,9.42 U$6.A15
UP
  Bottom 0.152: 48.68,12.47 UP.3 | 48.68,12.47 UP.4 52.61,12.47 54.41,10.68 54.41,8.94 56.03,7.32 87.68,7.32 U$6.A12 | R12.2 48.68,12.47
VCC  (via drill 0.33, 0.33 pad 0.69)
  Top 0.305: TM1.A 76.6,23.37 77.99,21.98 C1.1 | 99.43,24.61 99.43,26.37 98.79,27.01 IC4.1 98.79,28.82 96.89,28.82 IC4.3 | 99.43,24.61 99.43,23.3 v98.86,22.72 | v72.84,10.83 72.84,10.7 77.24,6.3 92.99,6.3 93.39,6.3 93.95,6.86 94.2,7.1 R3.1 | U$1.P$24 58.92,42.68 | 58.92,42.68 59,42.75 v67.85,42.75 70.51,45.41 v74.17,45.41 | 99.43,24.61 105.26,24.61 106.05,25.4 106.05,49.91 U$6.5V.. U$6.5V. | 29.21,49.16 52.44,49.16 58.92,42.68 | v29.21,39.37 29.21,49.16 | 29.21,49.16 22.32,49.16 R8.2 R9.1 19.8,48.77 18.82,48.77 12.88,48.77 12.8,48.77 12.19,49.38 12.19,50.58 IC3.8 12.12,51.89 11.43,52.58 11.43,53.18 C9.2
  Bottom 0.305: v72.84,10.83 65.47,10.83 65.44,10.81 R7.1 63.46,11.73 R10.1 59.52,12.9 57.4,15.03 52.19,15.03 51.34,14.17 R12.1 50.38,15.23 50.3,15.23 48.43,17.1 | TM1.A 71.63,24.43 68.53,27.54 52.42,27.54 | 48.43,17.1 47.26,15.93 42.01,15.93 39.26,13.17 R13.1 39.26,10.02 U$6.5V 49.92,6.74 R11.1 | R15.1 27.82,37.88 27.13,37.19 27.13,33.37 U$1.P$2 | R2.1 43.67,29.04 44.4,29.79 44.4,31.9 44.65,32.13 | 52.42,27.54 51.05,26.17 JP1.13 51.05,19.72 48.43,17.1 | C7.2 70.72,46.27 73.31,46.27 v74.17,45.41 89.85,45.41 | 49.41,32.13 49.66,32.13 50.7,31.09 50.7,29.26 52.42,27.54 | 67.8,42.8 v67.85,42.75 67.64,42.55 IC1.20 | 44.65,32.13 44.42,32.13 U$1.P$18 | 49.41,32.13 44.65,32.13 | 49.41,32.13 U$1.P$24 | U1.32 98.72,22.86 v98.86,22.72 | U$6.5V. 98.3,51.31 92.41,45.41 89.85,45.41 | C2.2 89.85,43.75 89.85,45.41 | R15.1 28.96,39.12 v29.21,39.37 | R14.1 R15.1

### Text on the board
tPlace: APU Mega Shield / Rev 1.02 / Dec 15, 2015 / / Designed by / CaitSith2 | WHITE | RED | D7 | D6 | D5 | D4 | D3 | D2 | D1 | D0 | E | R!W | RS | v0 | Vcc | Gnd | L+ | L- | HEADPHONE | LINEOUT | Micro SD